# EAGLE design exynos-backpack (EAGLE 6.4)
AUTHOR: Ryan Julian (ryanjulian@berkeley.edu); DESIGN_NAME: Exynos Backpack; REVISION: A; YEAR: 2013

## Sheet 1 of 2: Level Translator
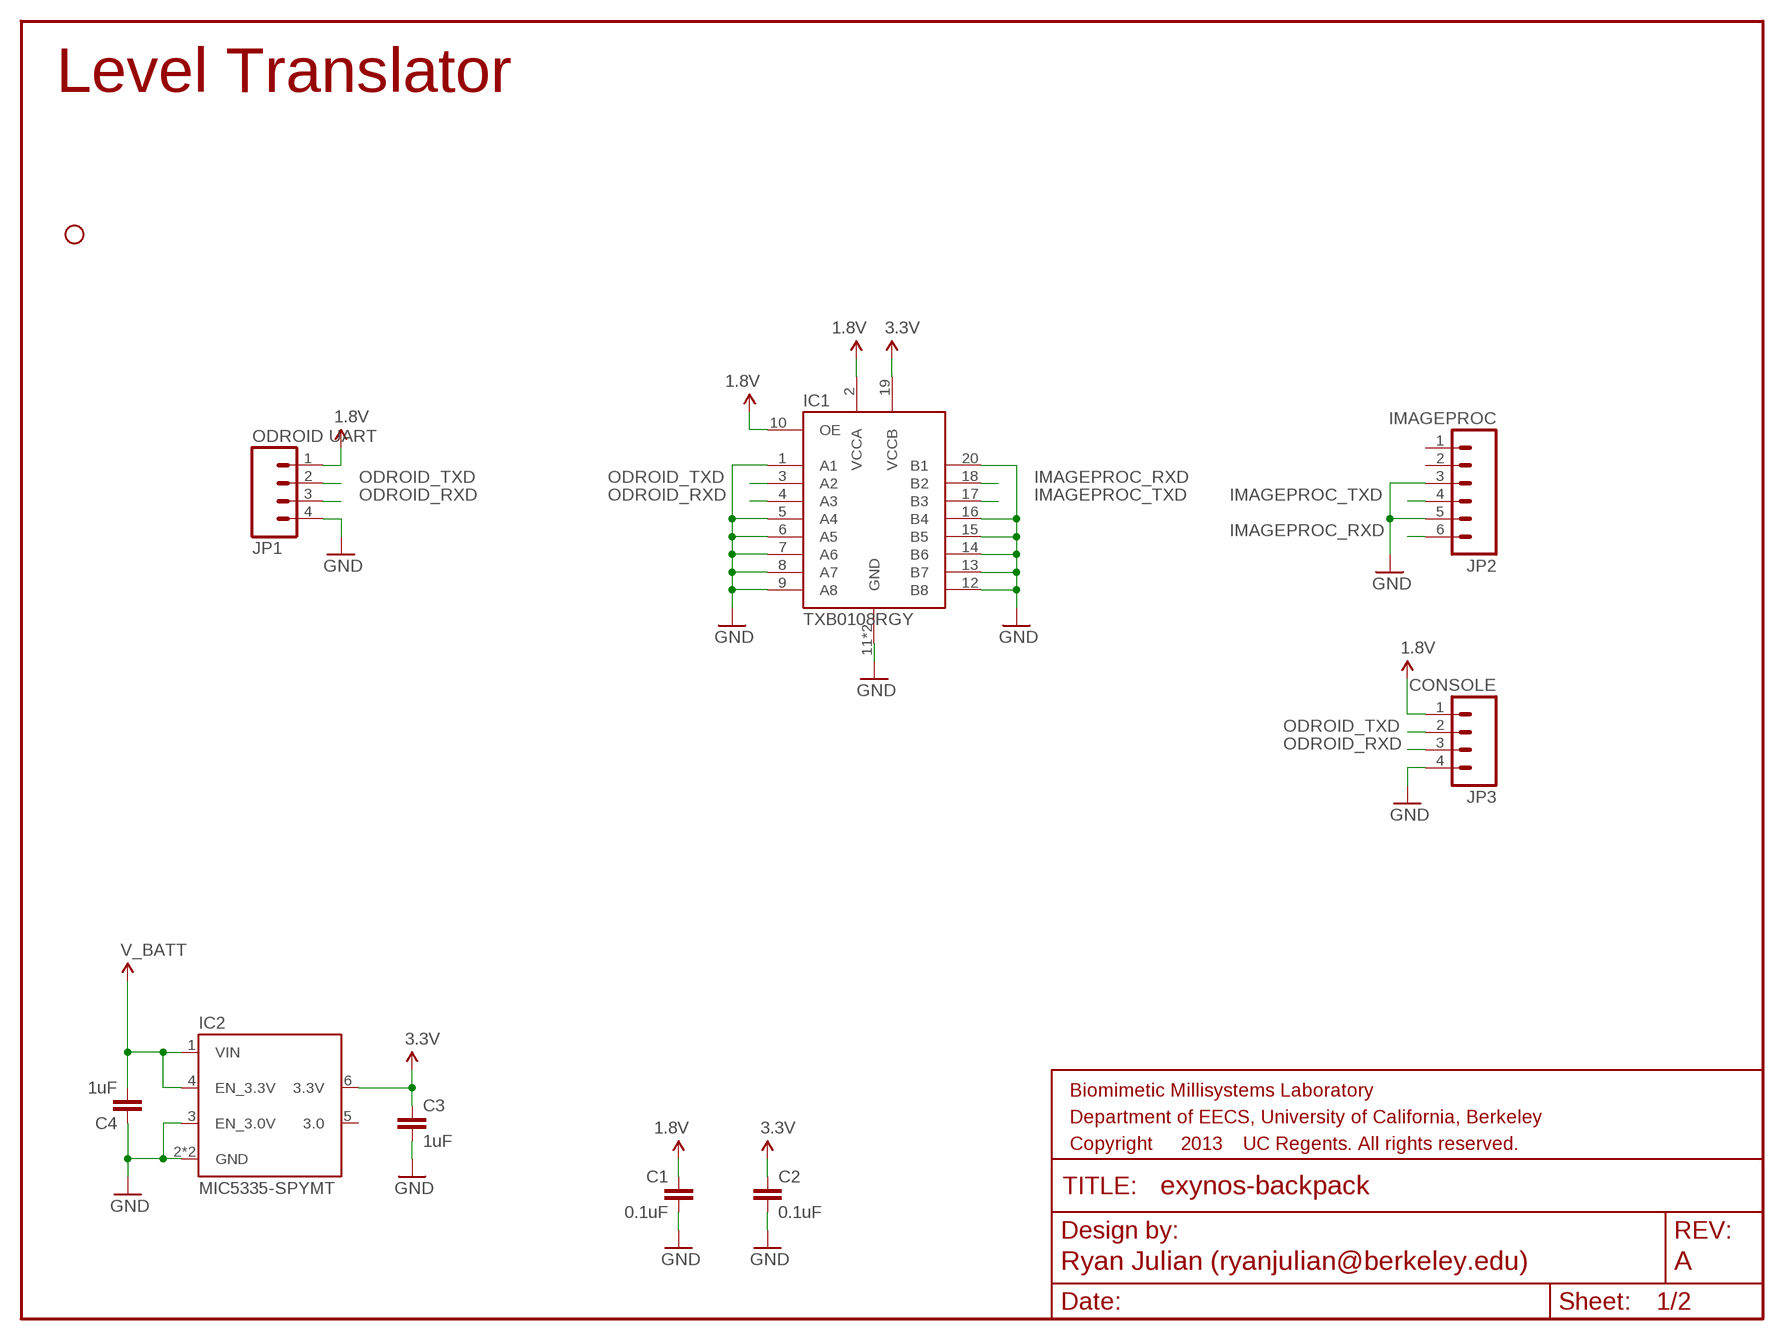
[diagram p0: schematic, sheet 1]
FRAME3 (FRAME-LETTER): SHEET_NAME: Exynos Backpack

### Parts
C1  0.1uF  CAP0402-CAP  [0402-CAP]
C2  0.1uF  CAP0402-CAP  [0402-CAP]
C3  1uF  CAP0402-CAP  [0402-CAP]
C4  1uF  CAP0402-CAP  [0402-CAP]
IC1  TXB0108RGY  [R-PVQFN-N20]
IC2  MIC5335-SPYMT  [MLF-6]
JP1  ODROID UART  M041X04_MOLEX_5267_NOSILK  [1X04_MOLEX_5267_NOSILK]
JP2  IMAGEPROC  MOLEX_503480-0600  [MOLEX_503480-0600]
JP3  CONSOLE  M04MOLEX_5267  [1X04_MOLEX_5267]
U$2  ODROID-U2  [ODROID-U2-KEEPOUT]

### Nets
1.8V: C1.1 IC1.2(VCCA) IC1.10(OE) JP1.1 JP3.1
3.3V: C2.1 C3.1 IC1.19(VCCB) IC2.6(3.3V)
GND: C1.2 C2.2 C3.2 C4.1 IC1.1(A1) IC1.5(A4) IC1.6(A5) IC1.7(A6) IC1.8(A7) IC1.9(A8) IC1.11(GND) IC1.12(B8) IC1.13(B7) IC1.14(B6) IC1.15(B5) IC1.16(B4) IC1.20(B1) IC1.EPAD(GND) IC2.2(GND) IC2.3(EN_3.0V) IC2.EPAD(GND) JP1.4 JP2.3 JP2.5 JP3.4 ; also sheet 2
IMAGEPROC_RXD: IC1.18(B2) JP2.6
IMAGEPROC_TXD: IC1.17(B3) JP2.4
ODROID_RXD: IC1.4(A3) JP1.3 JP3.3
ODROID_TXD: IC1.3(A2) JP1.2 JP3.2
V_BATT: C4.2 IC2.1(VIN) IC2.4(EN_3.3V) ; also sheet 2
Unconnected: IC2.5(3.0) JP2.1 JP2.2

### Notes on the sheet
- Level Translator

## Sheet 2 of 2: Boost Converter
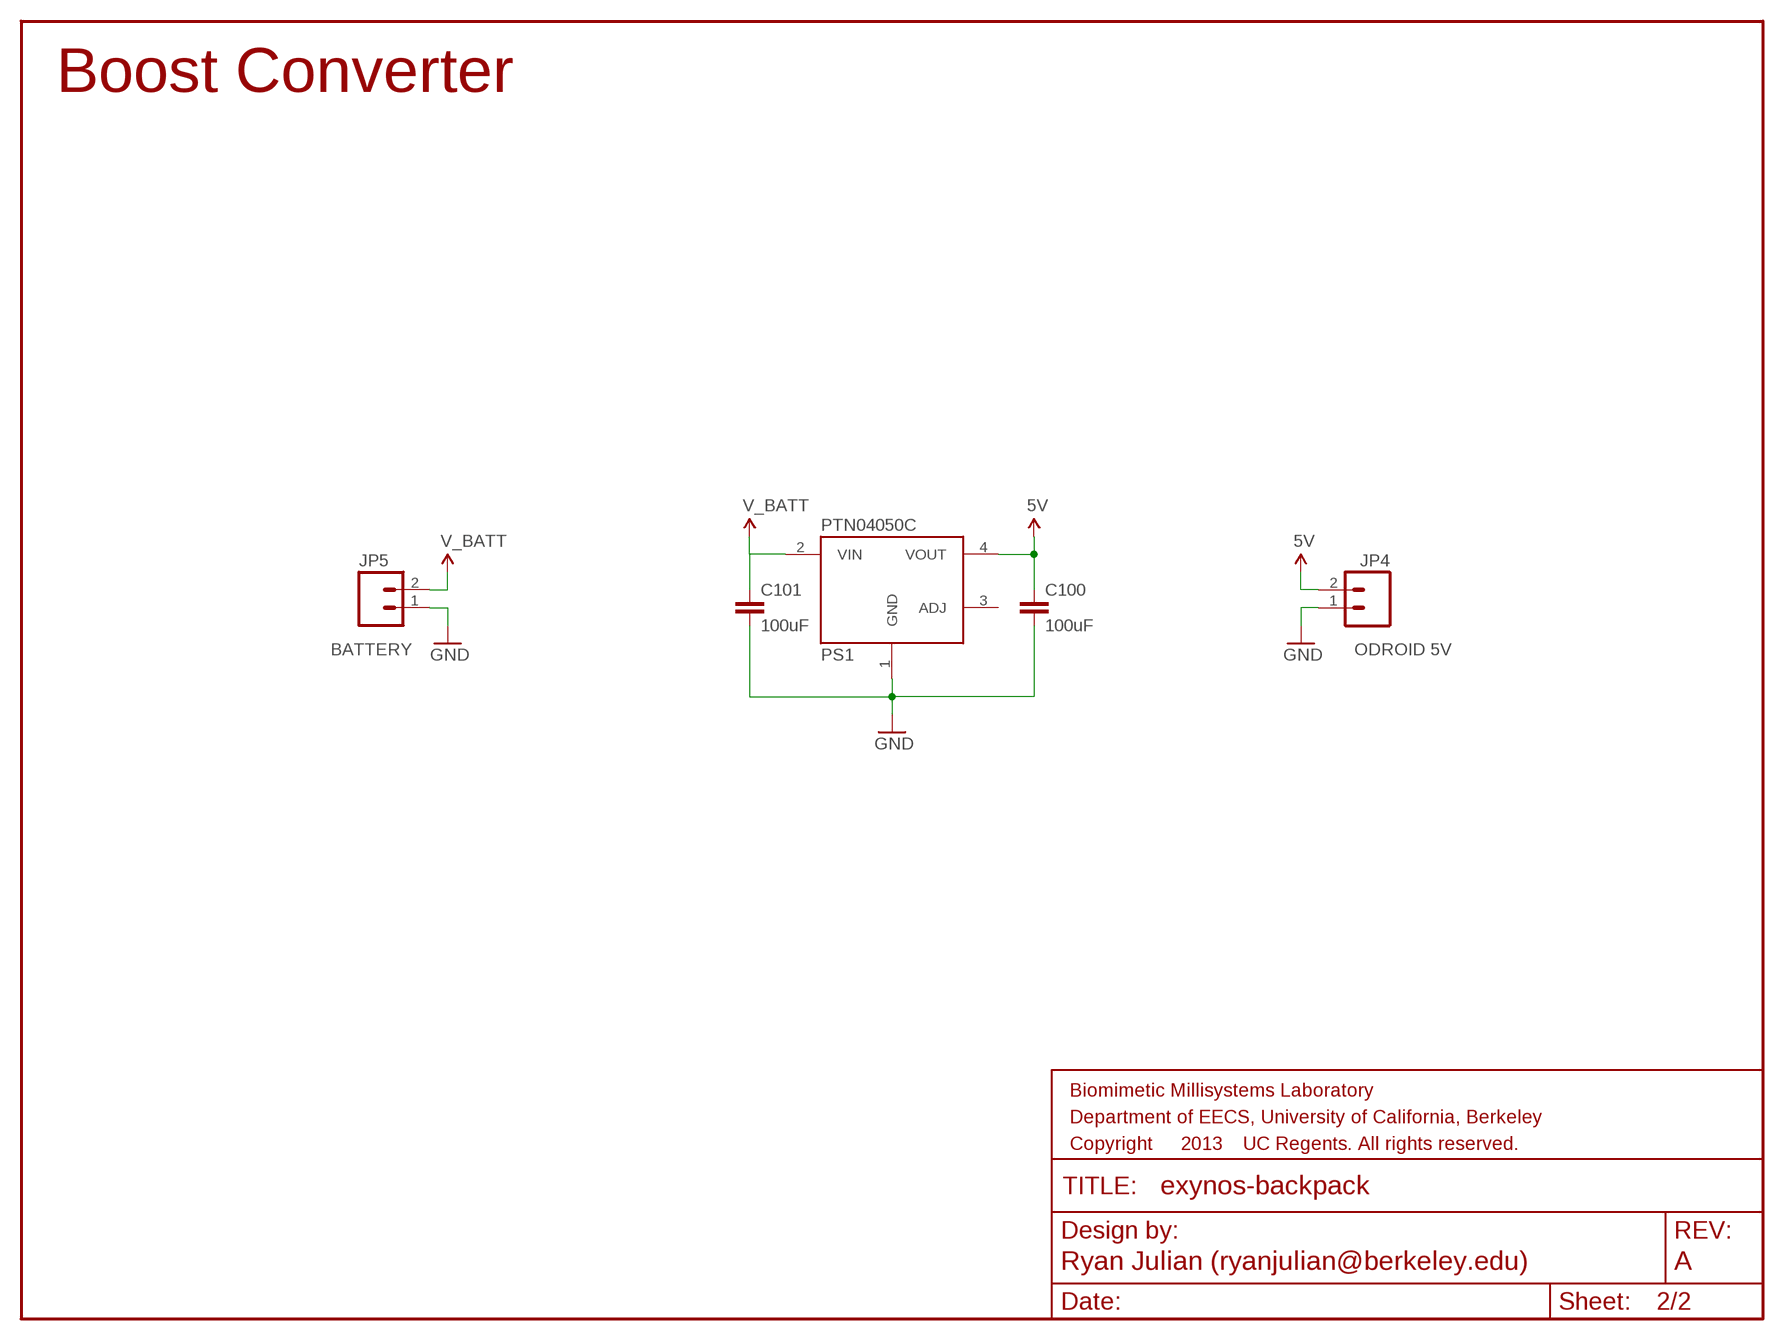
[diagram p1: schematic, sheet 2]

### Parts
C100  100uF  CAP1210  [1210]
C101  100uF  CAP1210  [1210]
JP4  ODROID 5V  JST-RCY-FEMALE-NOSILK  [JST-RCY-FEMALE_NOSILK]
JP5  BATTERY  JST-RCY-MALE-NOSILK  [JST-RCY-MALE_NOSILK]
PS1  PTN04050C  [PTN04050C]

### Nets
5V: C100.1 JP4.2 PS1.4(VOUT)
GND: C100.2 C101.2 JP4.1 JP5.1 PS1.1(GND) ; also sheet 1
V_BATT: C101.1 JP5.2 PS1.2(VIN) ; also sheet 1
Unconnected: PS1.3(ADJ)

### Notes on the sheet
- Boost Converter

## Library data of the parts
C1-C4 C100 C101 = biomimetic:CAP: Capacitor Standard 0603 ceramic capacitor, and 0.1" leaded capacitor.
IC1 = biomimetic:TXB0108
IC2 = biomimetic:MIC5335-SPYMT: Micrel MIC5335 150mA dual (3.3V/3.0V) voltage regulator.; DIGIKEY: 576-1949-1-ND
JP1 JP3 = biomimetic:M04: Header 4 Standard 4-pin 0.1" header. Use with straight break away headers (SKU : PRT-00116), right angle break away headers (PRT-00553), swiss pins (PRT-00743), machine pins (PRT-00117), and female headers (PRT-00115). Molex polarized connector foot print use with SKU : PRT-08231 with associated crimp pins and housings. 1MM SMD Version SKU: PRT-10208
JP2 = biomimetic:MOLEX_503480-0600: Molex FPC connector, 6 pos.; DIGIKEY: WM1387CT-ND
JP4 = biomimetic:JST-RCY-FEMALE
JP5 = biomimetic:JST-RCY-MALE: JST RCY male pigtail connector
PS1 = biomimetic:PTN04050C: TI PTN04050C 12-W, 3.3/5-V INPUT, WIDE OUTPUT ADJUSTABLE BOOST CONVERTER Digi-Key P/N: 296-20499-ND
U$2 = biomimetic:ODROID-U2

## Net classes
1 sup: width 0.254 mm

## Board
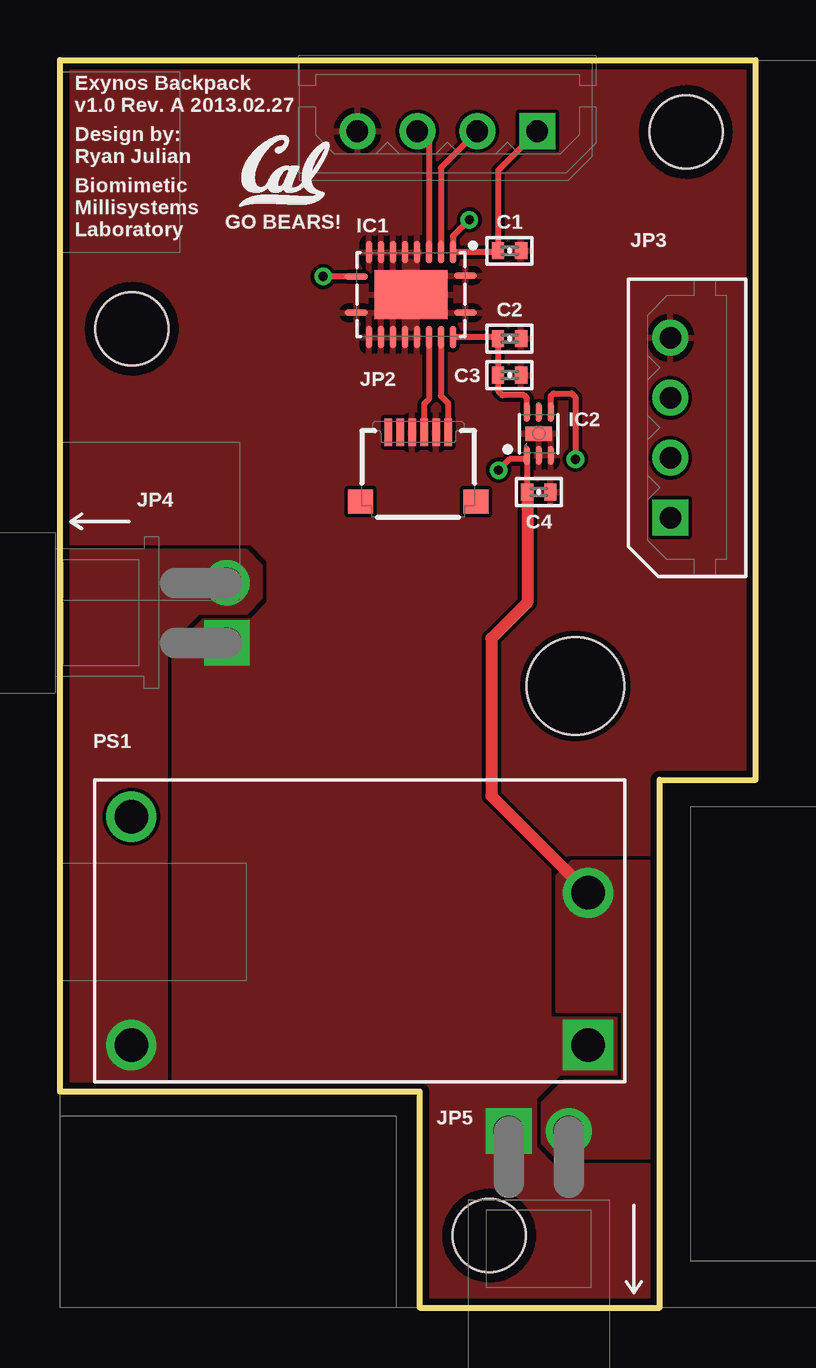
[diagram p2: board, top side]
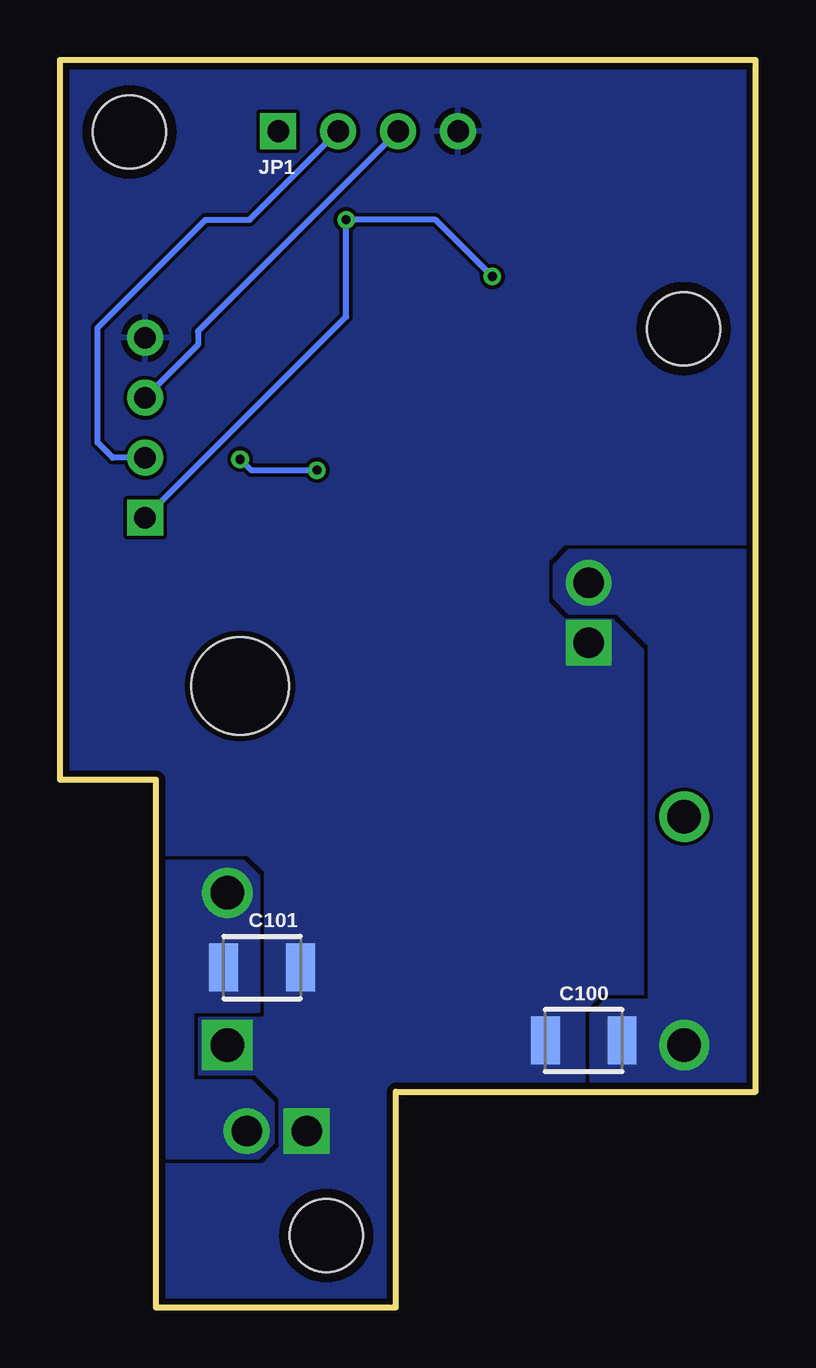
[diagram p3: board, bottom side, seen from below]

Size 29 x 52 mm. Coordinates in mm from the lower left corner, seen from the top.
Outline: 29,22 29,52 0,52 0,9 15,9 15,0 25,0 25,22 29,22
Copper layers (1*2+3*16): Top 2mil / dielectric 9mil / Route2 2mil / dielectric 40mil / Route3 2mil / dielectric 9mil / Bottom 2mil
Design rules "advancedcircuits-66each-biomimetic *": minimum track width 6mil, minimum drill 15mil, track to track 6mil, track to pad 6mil, pad to pad 6mil, via to via 6mil, smd to smd 6mil, copper to edge 10mil, drill to drill 7mil, minimum pad ring 7mil, minimum via ring 7mil, stop-mask expansion 3mil, vias tented up to drill 0mil, thermal gap 10mil
Holes 4.06 mm at 21.49,25.91
tKeepout: 8 lines
bKeepout: 8 lines

### Footprints (pad centres in the part's own frame; a part is rotated, then mirrored left to right if it is on the bottom)
0402-CAP = smd 0.508 x 0.711: 1 -0.483,0; 2 0.483,0
1210 = smd 1.2 x 2: 1 -1.6,0; 2 1.6,0
R-PVQFN-N20 = smd 0.95 x 0.28: 1 -2.275,-0.8; 10 2.275,-0.75; 11 2.275,0.75; 20 -2.275,0.75 | smd 0.28 x 0.95: 2 -1.75,-1.775; 3 -1.25,-1.775; 4 -0.75,-1.775; 5 -0.25,-1.775; 6 0.25,-1.775; 7 0.75,-1.775; 8 1.25,-1.775; 9 1.75,-1.775; 12 1.75,1.775; 13 1.25,1.775; 14 0.75,1.775; 15 0.25,1.775; 16 -0.25,1.775; 17 -0.75,1.775; 18 -1.25,1.775; 19 -1.75,1.775 | smd 3.05 x 2.05: EPAD 0,0
MLF-6 = smd 0.25 x 0.8: 1 -0.5,-0.9; 2 0,-0.9; 3 0.5,-0.9; 4 0.5,0.9; 5 0,0.9; 6 -0.5,0.9 | smd 1.1 x 0.6: EPAD 0,0
1X04_MOLEX_5267_NOSILK = drill 0.9 pad 1.5 square: 1 0,0 | drill 0.9 pad 1.5: 2 2.5,0; 3 5,0; 4 7.5,0
MOLEX_503480-0600 = smd 0.3 x 1.15: 1 -1.25,1.725; 2 -0.75,1.725; 3 -0.25,1.725; 4 0.25,1.725; 5 0.75,1.725; 6 1.25,1.725 | smd 1.035 x 1: L -2.408,-1.15; R 2.408,-1.15
1X04_MOLEX_5267 = drill 0.9 pad 1.5 square: 1 0,0 | drill 0.9 pad 1.5: 2 2.5,0; 3 5,0; 4 7.5,0
JST-RCY-FEMALE_NOSILK = drill 1.27 square: 1 -1.25,-3.15 | drill 1.27: 2 1.25,-3.15
JST-RCY-MALE_NOSILK = drill 1.27 square: 1 1.25,-7.35 | drill 1.27: 2 -1.25,-7.35
PTN04050C = drill 1.397 square: 1 -9.525,4.763 | drill 1.397: 2 -9.525,-1.587; 3 9.525,-4.763; 4 9.525,4.763
ODROID-U2-KEEPOUT = hole 3.048: 17.9,3; 3,40.8; 26.1,49

### Placement (x,y rotation side)
$$U$1  [CAL_LOGO]  7.47,45.87 0 top
C1  18.75,44.04 0 top
C2  18.75,40.39 0 top
C3  18.75,38.86 0 top
C4  19.96,33.99 180 top
C100  7.16,11.13 180 bottom
C101  20.57,14.17 0 bottom
IC1  14.63,42.21 180 top
IC2  19.96,36.42 0 top
JP1  19.9,49.03 180 top
JP2  14.94,34.75 0 top
JP3  25.45,32.92 90 top
JP4  3.81,28.96 90 top
JP5  19.96,0 180 top
PS1  12.5,15.7 180 top
U$2  0,0 0 top

### Tracks (layer width: path | path; a pad name or v marks a point on that pad's centre or on a via)
1.8V  (via drill 0.38)
  Top 0.254: JP1.1 18.26,47.39 C1.1 18.21,43.99 IC1.2 16.38,44.65 v17.07,45.34 | IC1.10 12.34,42.98 v10.97,42.98
  Bottom 0.254: JP3.1 17.07,41.3 v17.07,45.34 13.34,45.34 v10.97,42.98
3.3V
  Top 0.254: IC1.19 18.21,40.44 C2.1 C3.1 18.29,38.84 18.29,38.18 18.44,38.02 19.36,38.02 19.46,37.91 IC2.6
5V
  pour Top (no thermals): 7.77,28.96 5.79,28.96 4.42,27.58 4.42,8.99 0,8.99 0,31.55 7.77,31.55 8.38,30.94 8.38,29.57
  pour Bottom (no thermals): 6.86,12.19 6.25,12.8 1.83,12.8 1.22,12.19 1.22,8.99 6.86,8.99
  pour Bottom (no thermals): 7.77,28.96 5.79,28.96 4.42,27.58 4.42,8.99 0,8.99 0,31.55 7.77,31.55 8.38,30.94 8.38,29.57
GND
  pour Top (rank 6): 0,52 30.52,52 30.52,22 25,22 25,0 15,0 15,9 0,9
  pour Bottom (rank 6): 0,52 32.05,52 32.05,22 25,22 25,0 15,0 15,9 0,9
  pour Top (rank 2, no thermals): 0,31.55 24.99,31.55 24.99,5.49 15.09,5.49 15.09,8.99 0,8.99
  pour Bottom (rank 2, no thermals): 0,31.55 24.99,31.55 24.99,5.49 15.09,5.49 15.09,8.99 0,8.99
IMAGEPROC_RXD
  Top 0.254: IC1.18 15.88,37.99 16.18,37.69 JP2.6
IMAGEPROC_TXD
  Top 0.254: IC1.17 15.38,37.86 15.19,37.66 JP2.4
ODROID_RXD
  Top 0.254: JP1.3 15.38,48.55 IC1.4
  Bottom 0.254: JP1.3 23.24,40.69 23.24,40.13 JP3.3
ODROID_TXD
  Top 0.254: JP1.2 15.88,47.51 IC1.3
  Bottom 0.254: JP3.2 26.81,35.42 27.43,36.04 27.43,40.84 22.94,45.34 21.09,45.34 JP1.2
V_BATT  (via drill 0.38)
  Top 0.254: 19.46,35.36 19.46,34 C4.2 | IC2.4 20.46,37.99 20.57,38.1 21.34,38.1 21.49,37.95 v21.49,35.36 | IC2.1 19.46,35.36 | 19.46,35.36 18.75,35.36 v18.29,34.9
  Top 0.508: C4.2 19.48,29.39 17.98,27.89 17.98,21.32 PS1.2
  Bottom 0.254: v21.49,35.36 21.03,34.9 v18.29,34.9
  pour Bottom (no thermals): 20.12,6.86 20.73,6.25 24.99,6.25 24.99,18.59 21.34,18.59 20.73,17.98 20.73,12.34 23.47,12.34 23.47,9.45 21.03,9.45 20.12,8.53
  pour Top (no thermals): 20.12,6.86 20.73,6.25 24.99,6.25 24.99,18.59 21.34,18.59 20.73,17.98 20.73,12.34 23.47,12.34 23.47,9.45 21.03,9.45 20.12,8.53

### Text on the board
tPlace: Exynos Backpack / v1.0 Rev. A 2013.02.27 | Design by: / Ryan Julian | Biomimetic / Millisystems / Laboratory | GO BEARS!